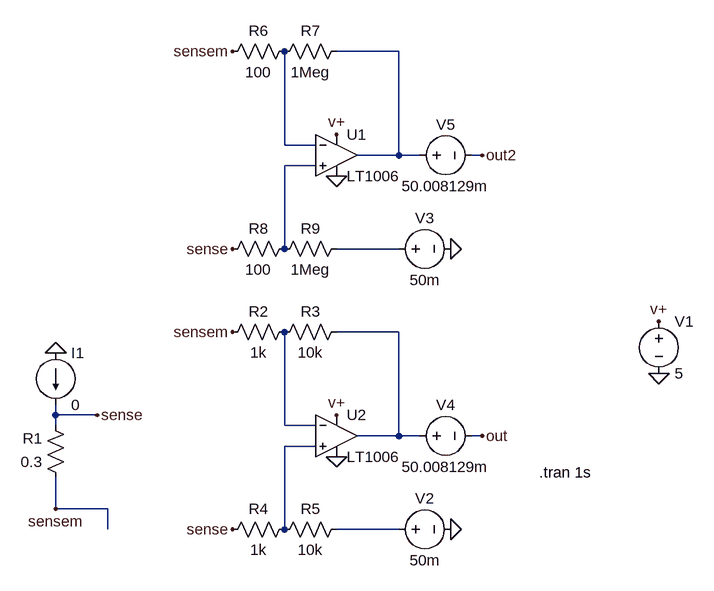
[diagram p0: schematic difference-amp.asc]
difference-amp.asc, the LTspice schematic file:
Version 4
SHEET 1 976 680
WIRE 272 -416 176 -416
WIRE 96 -272 96 -416
WIRE 144 -272 96 -272
WIRE 272 -256 272 -416
WIRE 272 -256 208 -256
WIRE 304 -256 272 -256
WIRE 400 -256 384 -256
WIRE 144 -240 96 -240
WIRE 96 -112 96 -240
WIRE 272 -112 176 -112
WIRE 272 16 176 16
WIRE -256 144 -256 128
WIRE -192 144 -256 144
WIRE -256 160 -256 144
WIRE 96 160 96 16
WIRE 144 160 96 160
WIRE 272 176 272 16
WIRE 272 176 208 176
WIRE 304 176 272 176
WIRE 400 176 384 176
WIRE 144 192 96 192
WIRE -256 288 -256 240
WIRE -176 288 -256 288
WIRE -176 320 -176 288
WIRE 96 320 96 192
WIRE 272 320 176 320
FLAG 176 208 0
FLAG -256 48 0
FLAG 672 80 0
FLAG 672 0 v+
FLAG 176 144 v+
FLAG -192 144 sense
FLAG 16 320 sense
FLAG 400 176 out
FLAG 352 320 0
FLAG -256 288 sensem
FLAG 16 16 sensem
FLAG 176 -224 0
FLAG 176 -288 v+
FLAG 16 -112 sense
FLAG 400 -256 out2
FLAG 352 -112 0
FLAG 16 -416 sensem
SYMBOL res -240 256 R180
WINDOW 0 36 76 Left 2
WINDOW 3 36 40 Left 2
SYMATTR InstName R1
SYMATTR Value 0.3
SYMBOL voltage 672 -16 R0
SYMATTR InstName V1
SYMATTR Value 5
SYMBOL res 112 0 R90
WINDOW 0 0 56 VBottom 2
WINDOW 3 32 56 VTop 2
SYMATTR InstName R2
SYMATTR Value 1k
SYMBOL res 192 0 R90
WINDOW 0 0 56 VBottom 2
WINDOW 3 32 56 VTop 2
SYMATTR InstName R3
SYMATTR Value 10k
SYMBOL res 112 304 R90
WINDOW 0 0 56 VBottom 2
WINDOW 3 32 56 VTop 2
SYMATTR InstName R4
SYMATTR Value 1k
SYMBOL res 192 304 R90
WINDOW 0 0 56 VBottom 2
WINDOW 3 32 56 VTop 2
SYMATTR InstName R5
SYMATTR Value 10k
SYMBOL Opamps\\LT1006 176 112 R0
SYMATTR InstName U2
SYMBOL voltage 256 320 R270
WINDOW 0 32 56 VTop 2
WINDOW 3 -32 56 VBottom 2
SYMATTR InstName V2
SYMATTR Value 50m
SYMBOL voltage 288 176 R270
WINDOW 0 32 56 VTop 2
WINDOW 3 -32 56 VBottom 2
SYMATTR InstName V4
SYMATTR Value 50.008129m
SYMBOL current -256 48 R0
SYMATTR InstName I1
SYMATTR Value 0
SYMBOL res 112 -432 R90
WINDOW 0 0 56 VBottom 2
WINDOW 3 32 56 VTop 2
SYMATTR InstName R6
SYMATTR Value 100
SYMBOL res 192 -432 R90
WINDOW 0 0 56 VBottom 2
WINDOW 3 32 56 VTop 2
SYMATTR InstName R7
SYMATTR Value 1Meg
SYMBOL res 112 -128 R90
WINDOW 0 0 56 VBottom 2
WINDOW 3 32 56 VTop 2
SYMATTR InstName R8
SYMATTR Value 100
SYMBOL res 192 -128 R90
WINDOW 0 0 56 VBottom 2
WINDOW 3 32 56 VTop 2
SYMATTR InstName R9
SYMATTR Value 1Meg
SYMBOL Opamps\\LT1006 176 -320 R0
SYMATTR InstName U1
SYMBOL voltage 256 -112 R270
WINDOW 0 32 56 VTop 2
WINDOW 3 -32 56 VBottom 2
SYMATTR InstName V3
SYMATTR Value 50m
SYMBOL voltage 288 -256 R270
WINDOW 0 32 56 VTop 2
WINDOW 3 -32 56 VBottom 2
SYMATTR InstName V5
SYMATTR Value 50.008129m
TEXT 488 232 Left 2 !.tran 1s

The netlist it stands for:
* difference-amp.asc
R1 sensem sense 0.3
V1 v+ 0 5
R2 N006 sensem 1k
R3 N005 N006 10k
R4 N007 sense 1k
R5 N008 N007 10k
XU2 N007 N006 v+ 0 N005 LT1006  ; pins In+ In- V+ V- OUT
V2 N008 0 50m
V4 N005 out 50.008129m
I1 0 sense 0
R6 N002 sensem 100
R7 N001 N002 1Meg
R8 N003 sense 100
R9 N004 N003 1Meg
XU1 N003 N002 v+ 0 N001 LT1006  ; pins In+ In- V+ V- OUT
V3 N004 0 50m
V5 N001 out2 50.008129m
.tran 1s
.lib LTC.lib
.backanno
.end